# Altium schematic sheet Schemat_blokowy.SchDoc
size A4; SheetNumber: 1; SheetTotal: 3
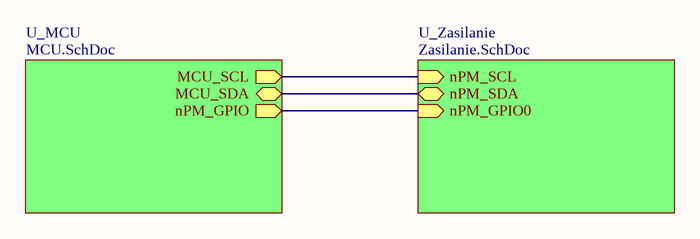
[diagram p0: Schemat_blokowy.SchDoc]

## Sub-sheets
U_MCU = MCU.SchDoc: MCU_SCL (out), MCU_SDA (bidir), nPM_GPIO (out)
U_Zasilanie = Zasilanie.SchDoc: nPM_SCL (in), nPM_SDA (bidir), nPM_GPIO0 (in)

## Nets
(unnamed): sheet U_Zasilanie/nPM_SCL, sheet U_MCU/MCU_SCL
(unnamed): sheet U_Zasilanie/nPM_SDA, sheet U_MCU/MCU_SDA
(unnamed): sheet U_Zasilanie/nPM_GPIO0, sheet U_MCU/nPM_GPIO